# Altium schematic sheet MCU.SchDoc
size A3; SheetNumber: 1; SheetTotal: 2
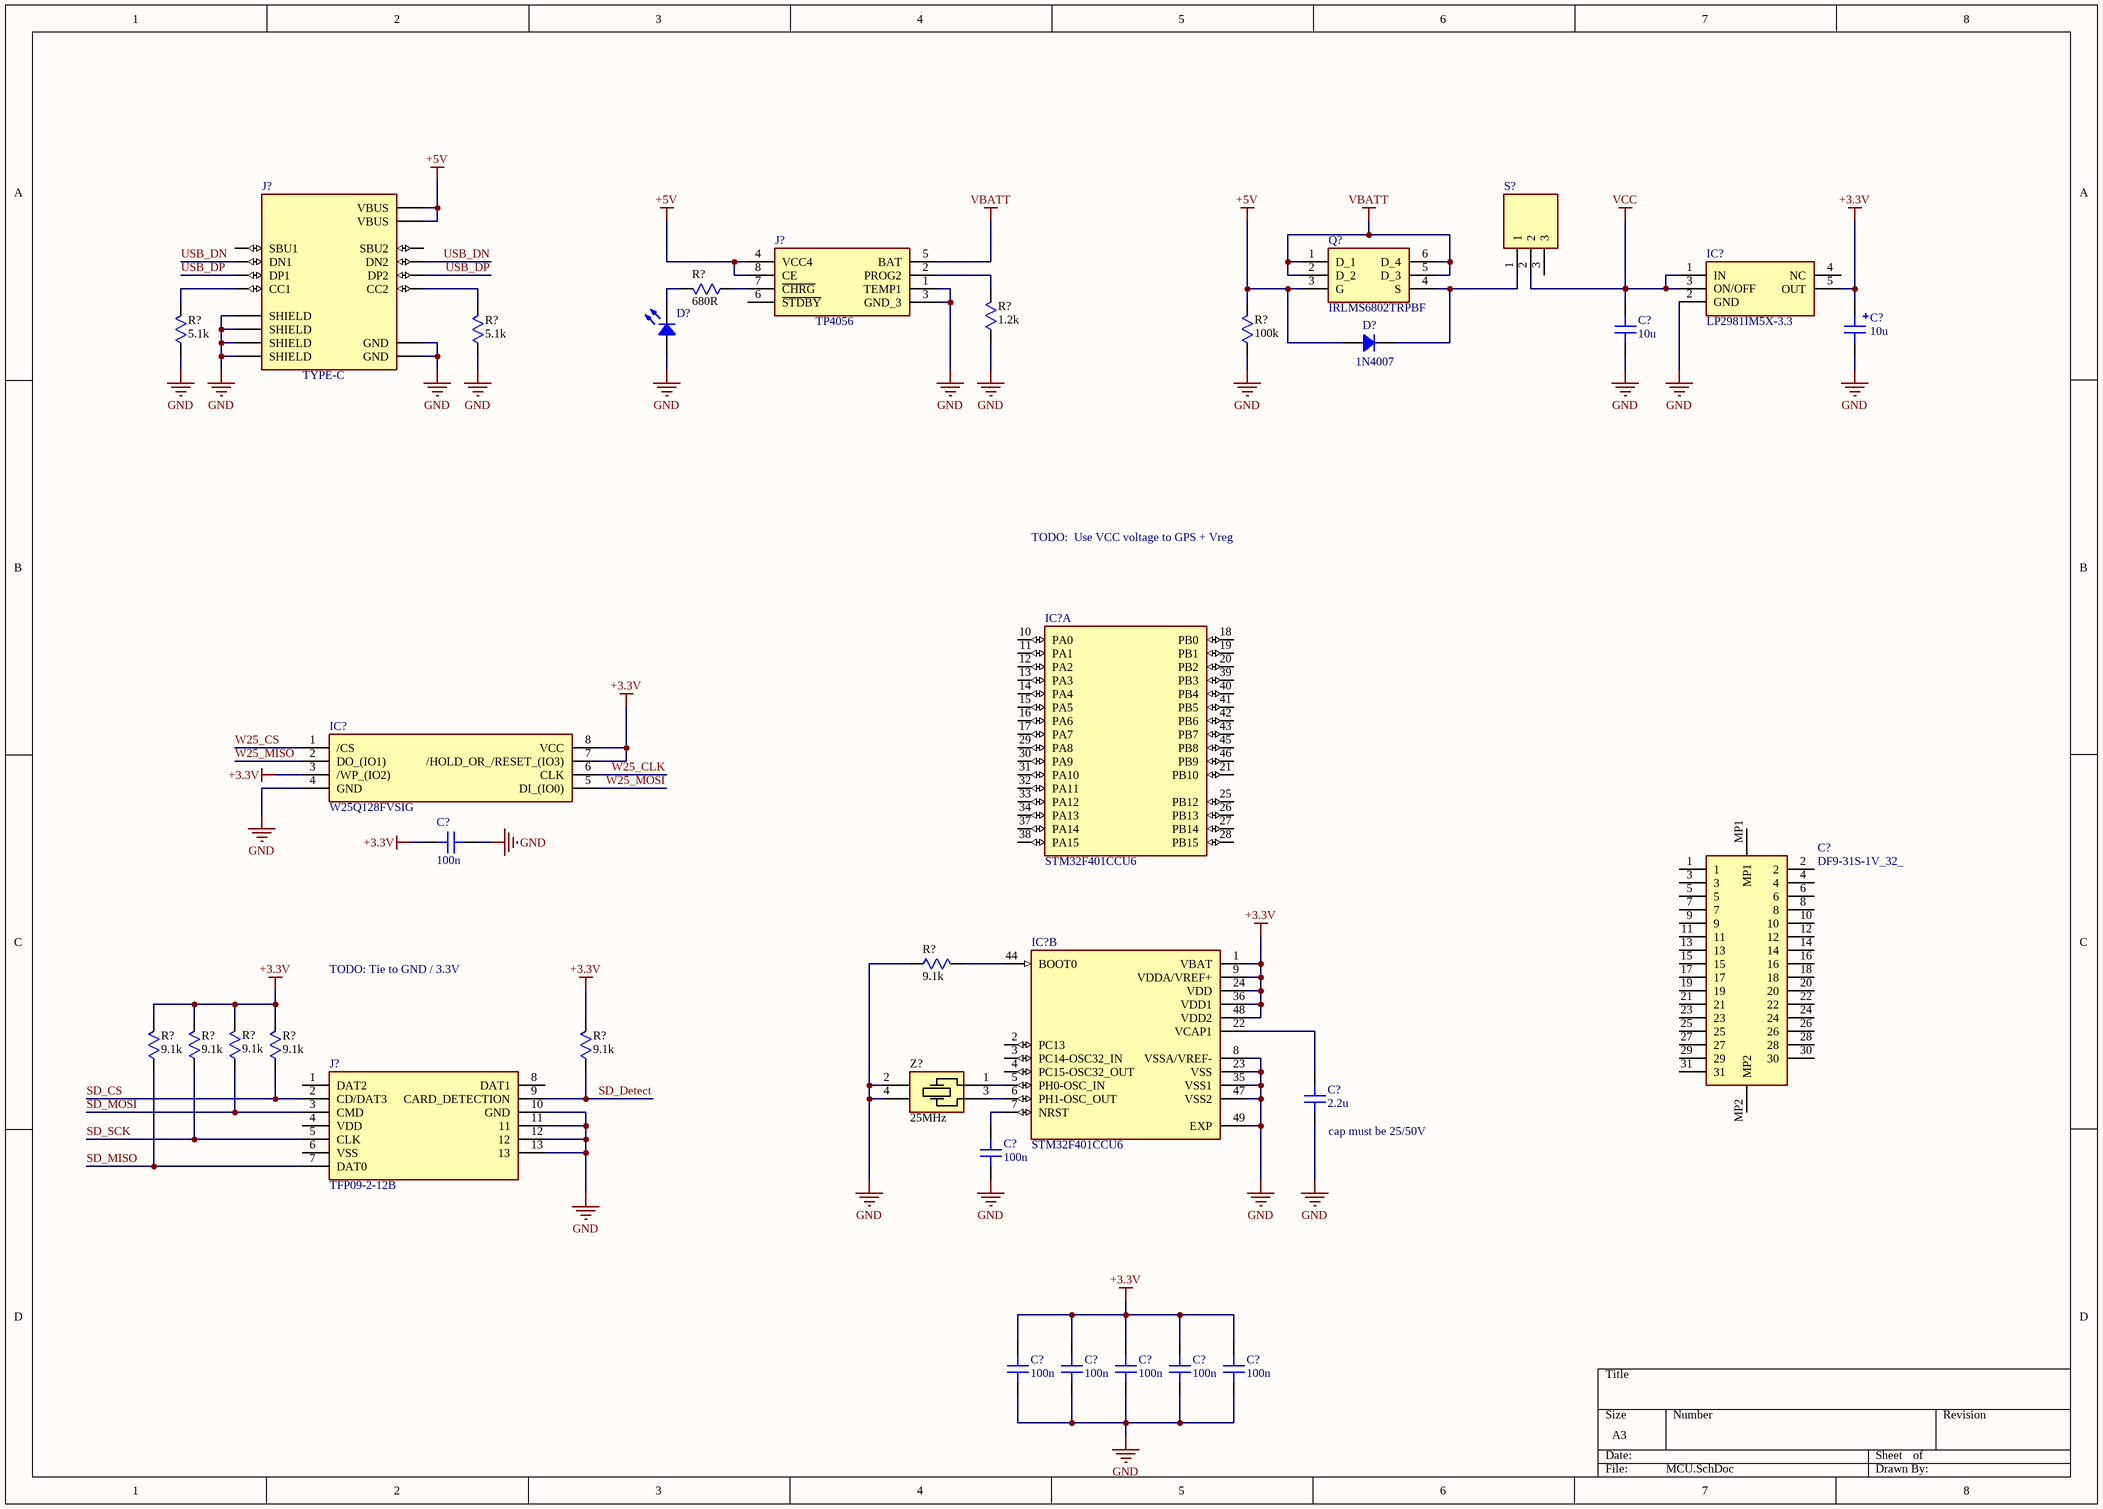
[diagram p0: MCU.SchDoc]

## Parts
(Parts that share a designator on the sheet are numbered #1, #2 ... from top to bottom, then left to right.)
C?#1  10u  [CAP: 1206]
C?#2  10u  [CAP: TANTAL-A]
C?#3  DF9-31S-1V_32_  [DF931S1V32]
C?#4  100n  [CAP: 0603]
C?#5  2.2u  [CAP: 0805]
C?#6  100n  [CAP: 0603]
C?#7  100n  [CAP: 0603]
C?#8  100n  [CAP: 0603]
C?#9  100n  [CAP: 0603]
C?#10  100n  [CAP: 0603]
C?#11  100n  [CAP: 0603]
D?#1  (no value)  [LED 0603_1608]
D?#2  1N4007  [DIODE: SMA]
IC?#1  LP2981IM5X-3.3  [SOT95P280X145-5N]
IC?#2  STM32F401CCU6  [QFN50P700X700X60-49N-D]  (part A of 2)
IC?#3  W25Q128FVSIG  [SOIC127P790X216-8N]
IC?#4  STM32F401CCU6  [QFN50P700X700X60-49N-D]  (part B of 2)
J?#1  TYPE-C  [HRO_TYPE-C-31-M-12]
J?#2  TP4056  [SOIC127P600X175-9N]
J?#3  TFP09-2-12B  [TFP09212B]
Q?  IRLMS6802TRPBF  [SOT95P280X130-6N]
R?#1  value 680R  [RES: 0603]
R?#2  value 1.2k  [RES: 0805]
R?#3  value 5.1k  [RES: 0603]
R?#4  value 5.1k  [RES: 0603]
R?#5  value 100k  [RES: 0603]
R?#6  value 9.1k  [RES: 0603]
R?#7  value 9.1k  [RES: 0603]
R?#8  value 9.1k  [RES: 0603]
R?#9  value 9.1k  [RES: 0603]
R?#10  value 9.1k  [RES: 0603]
R?#11  value 9.1k  [RES: 0603]
S?  OS102011MA1QN1  [OS102011MA1QN1]  (value not drawn)
Z?  Frequency: 25MHz  [OSC: 3225]

## Nets
+3.3V: C?#2.1 C?#4.2 C?#7.2 C?#8.2 C?#9.2 C?#10.2 C?#11.2 IC?#1.5(OUT) IC?#3.3(/WP_(IO2)) IC?#3.7(/HOLD_OR_/RESET_(IO3)) IC?#3.8(VCC) IC?#4.1(VBAT) IC?#4.9(VDDA/VREF+) IC?#4.24(VDD) IC?#4.36(VDD1) IC?#4.48(VDD2) R?#7.2 R?#8.2 R?#9.2 R?#10.2 R?#11.2
+5V: D?#2.1 J?#1.A4B9(VBUS) J?#1.B4A9(VBUS) J?#2.4(VCC4) J?#2.8(CE) Q?.3(G) R?#5.2
GND: C?#1.1 C?#2.2 C?#4.1 C?#5.1 C?#6.1 C?#7.1 C?#8.1 C?#9.1 C?#10.1 C?#11.1 D?#1.1 IC?#1.2(GND) IC?#3.4(GND) IC?#4.8(VSSA/VREF-) IC?#4.23(VSS) IC?#4.35(VSS1) IC?#4.47(VSS2) IC?#4.49(EXP) J?#1.A1B12(GND) J?#1.B1A12(GND) J?#1.S1(SHIELD) J?#1.S2(SHIELD) J?#1.S3(SHIELD) J?#1.S4(SHIELD) J?#2.1(TEMP1) J?#2.3(GND_3) J?#3.10(GND) J?#3.11 J?#3.12 J?#3.13 R?#2.1 R?#3.1 R?#4.1 R?#5.1 R?#6.1 Z?.2 Z?.4
VBATT: J?#2.5(BAT) Q?.1(D_1) Q?.2(D_2) Q?.5(D_3) Q?.6(D_4)
VCC: C?#1.2 IC?#1.1(IN) IC?#1.3(ON/OFF) S?.2
SD_CS: J?#3.2(CD/DAT3) R?#10.1
SD_Detect: J?#3.9(CARD_DETECTION) R?#11.1
SD_MISO: J?#3.7(DAT0) R?#7.1
SD_MOSI: J?#3.3(CMD) R?#9.1
SD_SCK: J?#3.5(CLK) R?#8.1
USB_DN: J?#1.A7(DN1) J?#1.B7(DN2)
USB_DP: J?#1.A6(DP1) J?#1.B6(DP2)
W25_CLK: IC?#3.6(CLK)
W25_CS: IC?#3.1(/CS)
W25_MISO: IC?#3.2(DO_(IO1))
W25_MOSI: IC?#3.5(DI_(IO0))
NetC?#5_2: C?#5.2 IC?#4.22(VCAP1)
NetC?#6_2: C?#6.2 IC?#4.7(NRST)
NetD?#1_2: D?#1.2 R?#1.2
NetD?#2_2: D?#2.2 Q?.4(S) S?.1
NetIC?#4_5: IC?#4.5(PH0-OSC_IN) Z?.1
NetIC?#4_6: IC?#4.6(PH1-OSC_OUT) Z?.3
NetIC?#4_44: IC?#4.44(BOOT0) R?#6.2
NetJ?#1_A5: J?#1.A5(CC1) R?#3.2
NetJ?#1_B5: J?#1.B5(CC2) R?#4.2
NetJ?#2_2: J?#2.2(PROG2) R?#2.2
NetJ?#2_7: J?#2.7(~{CHRG}) R?#1.1

Not connected (* = marked no-connect by the designer): C?#3 1 2 3 4 5 6 7 8 9 10 11 12 13 14 15 16 17 18 19 20 21 22 23 24 25 26 27 28 29 30 31 MP1 MP2; IC?#1 4(NC); IC?#2 10(PA0) 11(PA1) 12(PA2) 13(PA3) 14(PA4) 15(PA5) 16(PA6) 17(PA7) 18(PB0) 19(PB1) 20(PB2) 21(PB10) 25(PB12) 26(PB13) 27(PB14) 28(PB15) 29(PA8) 30(PA9) 31(PA10) 32(PA11) 33(PA12) 34(PA13) 37(PA14) 38(PA15) 39(PB3) 40(PB4) 41(PB5) 42(PB6) 43(PB7) 45(PB8) 46(PB9); IC?#4 2(PC13) 3(PC14-OSC32_IN) 4(PC15-OSC32_OUT); J?#1 A8(SBU1) B8(SBU2); J?#2 6(~{STDBY}); J?#3 1(DAT2) 4(VDD) 6(VSS) 8(DAT1); S? 3

## Notes on the sheet
- TODO:  Use VCC voltage to GPS + Vreg
- TODO: Tie to GND / 3.3V
- (near C?#5) cap must be 25/50V

## Library data of the parts
C?#1 C?#4-C?#11 = Capacitor: SMD Capacitor
C?#2 = Capacitor_polar: SMD Capacitor Polar
C?#3 = DF9-31S-1V_32_: Connector; Manufacturer_Name: Hirose; Manufacturer_Part_Number: DF9-31S-1V(32); Datasheet Link: http://www.mouser.com/ds/2/185/DF9_catalog-939217.pdf; Height: 3.3mm; Mouser Part Number: 798-DF9-31S-1V32; Mouser Price/Stock: https://www.mouser.co.uk/ProductDetail/Hirose-Connector/DF9-31S-1V32?qs=zOgoZG1CgI88k8P2oY2QVw%3D%3D; Arrow Part Number: DF9-31S-1V(32); Arrow Price/Stock: https://www.arrow.com/en/products/df9-31s-1v-32/hirose-electric
D?#1 = LED: Chip LED
D?#2 = Diode: Rectifier Diode
IC?#1 = LP2981IM5X-3.3: Integrated Circuit; Manufacturer_Name: Texas Instruments; Manufacturer_Part_Number: LP2981IM5X-5.0; Datasheet Link: https://www.ti.com/lit/ds/symlink/lp2981-n.pdf?ts=1629199672850&ref_url=https%253A%252F%252Fwww.ti.com%252Fstore%252Fti%252Fen%252Fp%252Fproduct%252F%253Fp%253DLP2981IM5X-5.0%252FNOPB; Height: 1.45mm; Mouser Part Number: 926-LP2981IM5X-50; Mouser Price/Stock: https://www.mouser.com/Search/Refine.aspx?Keyword=926-LP2981IM5X-50
IC?#2 IC?#4 = STM32F401CCU6: Integrated Circuit; Manufacturer_Name: STMicroelectronics; Datasheet Link: http://www.st.com/web/en/resource/technical/document/datasheet/DM00086815.pdf; Height: 0.6mm; Manufacturer_Part_Number: STM32F401CCU6; Mouser Part Number: 511-STM32F401CCU6; Mouser Price/Stock: https://www.mouser.co.uk/ProductDetail/STMicroelectronics/STM32F401CCU6?qs=DqCdCwOw4%2F5VrOZQxO795A%3D%3D; Arrow Part Number: STM32F401CCU6; Arrow Price/Stock: https://www.arrow.com/en/products/stm32f401ccu6/stmicroelectronics?region=nac
IC?#3 = W25Q128FVSIG: Integrated Circuit; Manufacturer_Name: Winbond; Datasheet Link: https://www.winbond.com/resource-files/w25q128fv rev.m 05132016 kms.pdf; Height: 2.16mm; Manufacturer_Part_Number: W25Q128FVSIG; Mouser Part Number: N/A; Mouser Price/Stock: https://www.mouser.co.uk/ProductDetail/Winbond/W25Q128FVSIG?qs=rkhjVJ6%2F3EIwu4pV702YLQ%3D%3D; Arrow Part Number: W25Q128FVSIG; Arrow Price/Stock: https://www.arrow.com/en/products/w25q128fvsig/winbond-electronics
J?#1 = TYPE-C-31-M-12: USB Connectors 24 Receptacle 1 8.94*7.3mm RoHS; Package: None; Availability: Unavailable; Value: *; MP: TYPE-C-31-M-12; Price: None
J?#2 = TP4056: Connector; Manufacturer_Name: NanJing Top Power; Datasheet Link: https://dlnmh9ip6v2uc.cloudfront.net/datasheets/Prototyping/TP4056.pdf; Height: 1.75mm; Manufacturer_Part_Number: TP4056
J?#3 = TFP09-2-12B: Connector; Manufacturer_Name: 100y; Datasheet Link: http://images.100y.com.tw/pdf_file/10-TFP09-2-12B.pdf; Height: 2.45mm; Manufacturer_Part_Number: TFP09-2-12B
Q? = IRLMS6802TRPBF: MOSFET (P-Channel); Manufacturer_Name: Infineon; Datasheet Link: https://www.infineon.com/dgdl/irlms6802pbf.pdf?fileId=5546d462533600a401535669349a2654; Height: 1.3mm; Manufacturer_Part_Number: IRLMS6802TRPBF; Mouser Part Number: 942-IRLMS6802TRPBF; Mouser Price/Stock: https://www.mouser.co.uk/ProductDetail/Infineon-IR/IRLMS6802TRPBF?qs=9%252BKlkBgLFf3%252B6QUsVmNV1g%3D%3D; Arrow Part Number: IRLMS6802TRPBF; Arrow Price/Stock: https://www.arrow.com/en/products/irlms6802trpbf/infineon-technologies-ag
R?#1-R?#11 = Resistor: Manufacturer: Yageo; PartNumber: RC0201JR-07100RL; TypeResistor: Resistor film; Power: 0.05W; Package: 0201; HelpURL: https://www.digikey.com/product-detail/en/yageo/RC0201JR-07100RL/311-100NCT-ND/1949006; ValueManufacturerPartNumber: =TypeResistor+', '+Value+', '+Tolerance+', '+Package+', '+Power+', '+Temperature; Temperature: -55...+125°C
S? = OS102011MA1QN1: Switch; Manufacturer_Name: C & K COMPONENTS; Datasheet Link: http://www.ckswitches.com/media/1428/os.pdf; Manufacturer_Part_Number: OS102011MA1QN1; Mouser Part Number: 611-OS102011MA1QN1; Mouser Price/Stock: https://www.mouser.co.uk/ProductDetail/CK/OS102011MA1QN1?qs=WtljUlYws5R6MUgHcLkz4w%3D%3D; Arrow Part Number: OS102011MA1QN1; Arrow Price/Stock: https://www.arrow.com/en/products/os102011ma1qn1/ck?region=europe
Z? = Crystal: Manufacturer: Murata Electronics; PartNumber: XRCGB25M000F0L00R0; ValueManufacturerPartNumber: Crystal, 25MHz, 6pF, ±50ppm, case 2016, -30...+85°C; LoadCapacitance: 6pF; Tolerance: ±50ppm; Package: case 2016; HelpURL: https://www.digikey.com/product-detail/en/murata-electronics-north-america/XRCGB25M000F0L00R0/490-5577-1-ND/2368391; Temperature: -30...+85°C; TypeOscilator: Crystal